# EAGLE design board (EAGLE 5.07)
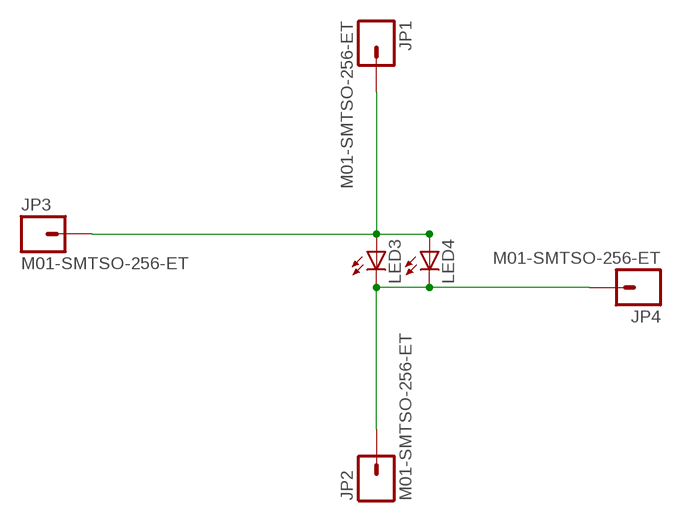
[diagram p0: schematic, sheet 1]

## Parts
JP1  M01-SMTSO-256-ET  [SMTSO-256-ET]
JP2  M01-SMTSO-256-ET  [SMTSO-256-ET]
JP3  M01-SMTSO-256-ET  [SMTSO-256-ET]
JP4  M01-SMTSO-256-ET  [SMTSO-256-ET]
LED3  LED5MM  [LED5MM]
LED4  LED5MM  [LED5MM]

## Nets
N$1: JP1.P$1 JP3.P$1 LED3.A LED4.A
N$2: JP2.P$1 JP4.P$1 LED3.K(C) LED4.K(C)

## Library data of the parts
JP1-JP4 = SparkFun:M01: Header 1 Standard 1-pin 0.1" header. Use with straight break away headers (SKU : PRT-00116), right angle break away headers (PRT-00553), swiss pins (PRT-00743), machine pins (PRT-00117), and female headers (PRT-00115).
LED3 LED4 = SparkFun:LED: LEDs Standard schematic elements and footprints for 5mm, 3mm, 1206, and 0603 sized LEDs. 5mm - Spark Fun Electronics SKU : COM-00529 (and others)

## Board
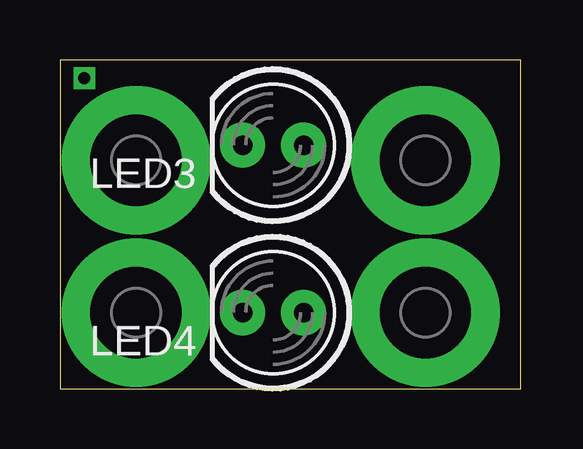
[diagram p1: board, top side]
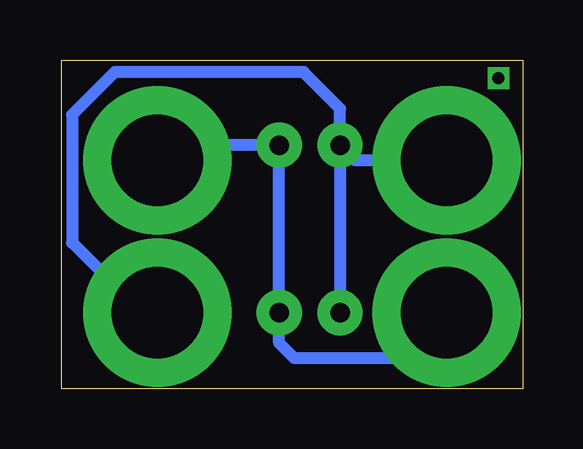
[diagram p2: board, bottom side, seen from below]

Size 19.23 x 13.71 mm. Coordinates in mm from the lower left corner, seen from the top.
Outline: 0,0 19.23,0 19.23,13.71 0,13.71 0,0
Copper layers (1*16): Top 0.035mm / dielectric 1.5mm / Bottom 0.035mm
Design rules "default": minimum track width 10mil, minimum drill 24mil, track to track 8mil, track to pad 8mil, pad to pad 8mil, via to via 8mil, smd to smd 8mil, copper to edge 40mil, drill to drill 8mil, minimum pad ring 10mil, minimum via ring 8mil, stop-mask expansion 4mil, vias tented up to drill 0mil, thermal gap 10mil

### Footprints (pad centres in the part's own frame; a part is rotated, then mirrored left to right if it is on the bottom)
SMTSO-256-ET = drill 3.81 pad 6.198 round: P$1 0,0
LED5MM = drill 0.813 pad 1.88 round: A -1.27,0; K 1.27,0

### Placement (x,y rotation side)
JP1  3.17,3.17 90 top
JP2  15.24,3.17 90 top
JP3  15.24,9.53 90 top
JP4  3.17,9.53 90 top
LED3  8.89,10.16 180 top
LED4  8.89,3.17 180 top

### Tracks (layer width: path | path; a pad name or v marks a point on that pad's centre or on a via)
N$1
  Bottom 0.508: JP1.P$1 5.08,1.27 9.53,1.27 10.16,1.91 LED4.A LED3.A 14.61,10.16 JP3.P$1
N$2
  Bottom 0.508: LED3.K LED4.K | JP4.P$1 6.99,9.53 LED3.K | JP2.P$1 15.88,3.17 18.8,6.1 18.8,11.43 17.02,13.21 9.14,13.21 7.62,11.68 LED3.K | LED3.K 7.37,10.41
N$3  (via drill 0.5)
  other vias: 1.02,12.95